# EAGLE schematic ProjetoFinal (EAGLE 8.4.0)
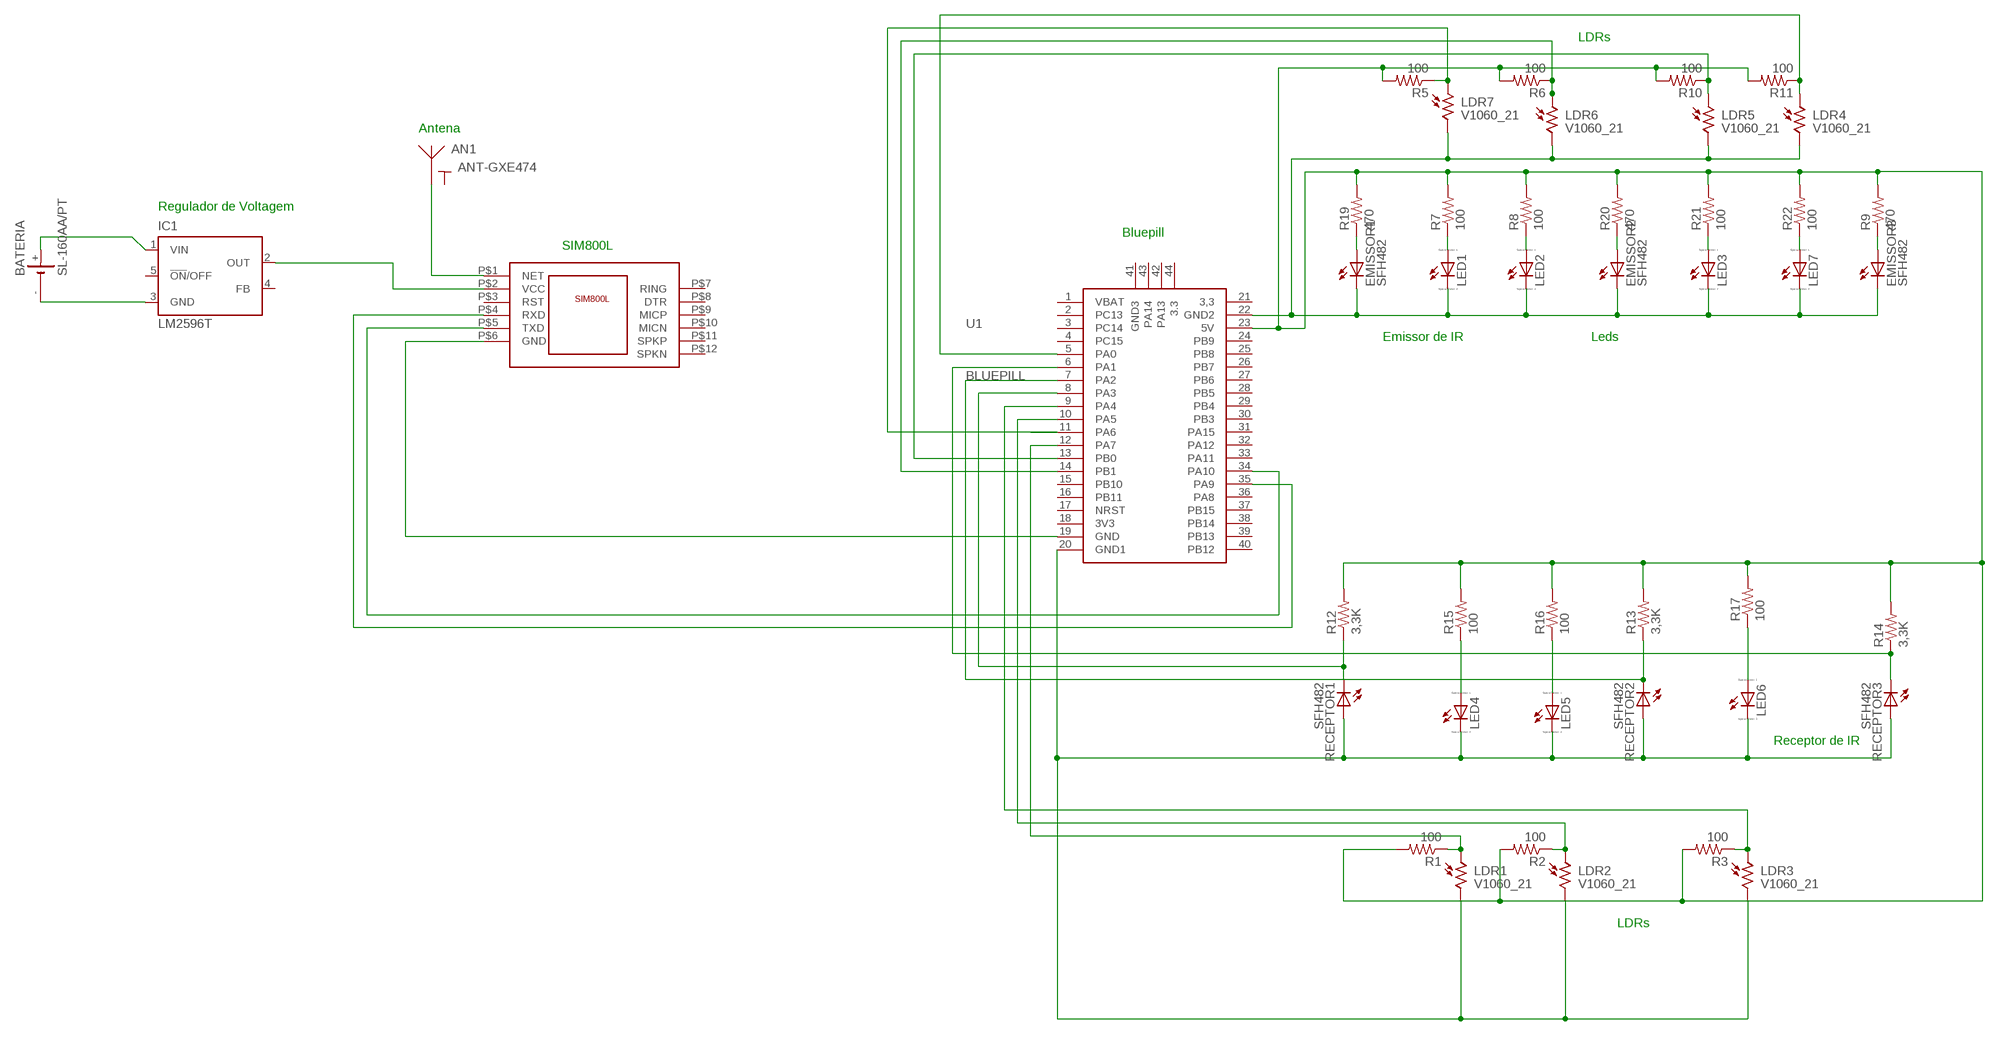
[diagram p0: schematic, sheet 1]

## Parts
AN1  ANT-GXE474  [ANT-GXE474]
BATERIA  SL-160AA/PT  [SL-160AA/PT]
EMISSOR1  SFH482  [SFH482]
EMISSOR2  SFH482  [SFH482]
EMISSOR3  SFH482  [SFH482]
IC1  LM2596T  [T05D]
LDR1  V1060_21  [TO-5_V10]
LDR2  V1060_21  [TO-5_V10]
LDR3  V1060_21  [TO-5_V10]
LDR4  V1060_21  [TO-5_V10]
LDR5  V1060_21  [TO-5_V10]
LDR6  V1060_21  [TO-5_V10]
LDR7  V1060_21  [TO-5_V10]
LED1  LED_E  [LED_1206]
LED2  LED_E  [LED_1206]
LED3  LED_E  [LED_1206]
LED4  LED_E  [LED_1206]
LED5  LED_E  [LED_1206]
LED6  LED_E  [LED_1206]
LED7  LED_E  [LED_1206]
R1  100  R-US_0204/5  [0204/5]
R2  100  R-US_0204/5  [0204/5]
R3  100  R-US_0204/5  [0204/5]
R5  100  R-US_0204/5  [0204/5]
R6  100  R-US_0204/5  [0204/5]
R7  100  R-US_0204/5  [0204/5]
R8  100  R-US_0204/5  [0204/5]
R9  470  R-US_0204/5  [0204/5]
R10  100  R-US_0204/5  [0204/5]
R11  100  R-US_0204/5  [0204/5]
R12  3,3K  R-US_0204/5  [0204/5]
R13  3,3K  R-US_0204/5  [0204/5]
R14  3,3K  R-US_0204/5  [0204/5]
R15  100  R-US_0204/5  [0204/5]
R16  100  R-US_0204/5  [0204/5]
R17  100  R-US_0204/5  [0204/5]
R19  470  R-US_0204/5  [0204/5]
R20  470  R-US_0204/5  [0204/5]
R21  100  R-US_0204/5  [0204/5]
R22  100  R-US_0204/5  [0204/5]
RECEPTOR1  SFH482  [SFH482]
RECEPTOR2  SFH482  [SFH482]
RECEPTOR3  SFH482  [SFH482]
U1  BLUEPILL  [BLUEPILL]
U2  SIM800L  [SIM800L]

## Nets
N$1: BATERIA.- IC1.3(GND)
N$2: AN1.2(ANT) U2.P$1(NET)
N$3: EMISSOR1.A R19.1
N$4: R1.2 R2.2 R3.2 R5.2 R6.2 R7.2 R8.2 R9.2 R10.2 R11.2 R12.2 R13.2 R14.2 R15.2 R16.2 R17.2 R19.2 R20.2 R21.2 R22.2 U1.23(5V)
N$5: LED4.A R15.1
N$6: LED5.A R16.1
N$7: LED6.A R17.1
N$8: R12.1 RECEPTOR1.K(C) U1.8(PA3)
N$9: LED1.A R7.1
N$10: LED2.A R8.1
N$11: U1.35(PA9) U2.P$4(RXD)
N$12: EMISSOR2.A R20.1
N$13: U1.19(GND) U2.P$6(GND)
N$14: U1.34(PA10) U2.P$5(TXD)
N$15: LED3.A R21.1
N$16: EMISSOR1.K(C) EMISSOR2.K(C) EMISSOR3.K(C) LDR4.2 LDR5.2 LDR6.2 LDR7.2 LED1.C LED2.C LED3.C LED7.C U1.22(GND2)
N$17: LED7.A R22.1
N$18: EMISSOR3.A R9.1
N$19: LDR1.1 R1.1 U1.12(PA7)
N$20: LDR2.1 R2.1 U1.10(PA5)
N$21: LDR3.1 R3.1 U1.9(PA4)
N$22: IC1.2(OUT) U2.P$2(VCC)
N$23: LDR5.1 R10.1 U1.13(PB0)
N$24: LDR4.1 R11.1 U1.5(PA0)
N$25: LDR6.1 R6.1 U1.14(PB1)
N$26: LDR1.2 LDR2.2 LDR3.2 LED4.C LED5.C LED6.C RECEPTOR1.A RECEPTOR2.A RECEPTOR3.A U1.20(GND1)
N$27: LDR7.1 R5.1
N$28: U1.11(PA6)
N$29: BATERIA.+ IC1.1(VIN)
N$30: R13.1 RECEPTOR2.K(C) U1.7(PA2)
N$31: R14.1 RECEPTOR3.K(C) U1.6(PA1)
Unconnected: AN1.1(G) BATERIA.-@1(-) IC1.4(FB) IC1.5(!ON!/OFF) U1.1(VBAT) U1.2(PC13) U1.3(PC14) U1.4(PC15) U1.15(PB10) U1.16(PB11) U1.17(NRST) U1.18(3V3) U1.21(3,3) U1.24(PB9) U1.25(PB8) U1.26(PB7) U1.27(PB6) U1.28(PB5) U1.29(PB4) U1.30(PB3) U1.31(PA15) U1.32(PA12) U1.33(PA11) U1.36(PA8) U1.37(PB15) U1.38(PB14) U1.39(PB13) U1.40(PB12) U1.41(GND3) U1.42(PA13) U1.43(PA14) U1.44(3.3) U2.P$3(RST) U2.P$7(RING) U2.P$8(DTR) U2.P$9(MICP) U2.P$10(MICN) U2.P$11(SPKP) U2.P$12(SPKN)

## Notes on the sheet
- LDRs
- Antena
- Regulador de Voltagem
- Bluepill
- SIM800L
- Emissor de IR | Leds
- Receptor de IR
- LDRs

## Library data of the parts
AN1 = roundsolutions:ANT-GXE474: Embedded GSM /UMTS antenna ANT-GXE474 Source: ANT-GXE474.pdf
BATERIA = battery:SL-160AA/PT: LI BATTERY Sonnenschein
EMISSOR1-EMISSOR3 RECEPTOR1-RECEPTOR3 = led:SFH482: IR LED infrared emitting diode, Infineon
IC1 = national-semiconductor:LM2596: SIMPLE SWITCHER® Power Converter 150 kHz 3A Step-Down Voltage Regulator Source: http://www.national.com/ds/LM/LM2596.pdf; MPN: LM2596T-ADJ/LF02; OC_FARNELL: 9494162; OC_NEWARK: 65K5910
LDR1-LDR7 = photo-elements:?1060*: Sensor Street Light control Source: http://optoelectronics.perkinelmer.com/content/Datasheets/DTS_PhotocellsB1060.pdf
LED1-LED7 = eagle-ltspice:LED_E: LED Source: http://www.osram.convergy.de Source: www.luxeon.com Source: www.kingbright.com; SPICEMODEL: NONE; SPICEPREFIX: D; SPICETYPE: diode
R1-R3 R5-R17 R19-R22 = resistor:R-US_: RESISTOR, American symbol
U1 = minhalib:BLUEPILL
U2 = sim800l:SIM800L